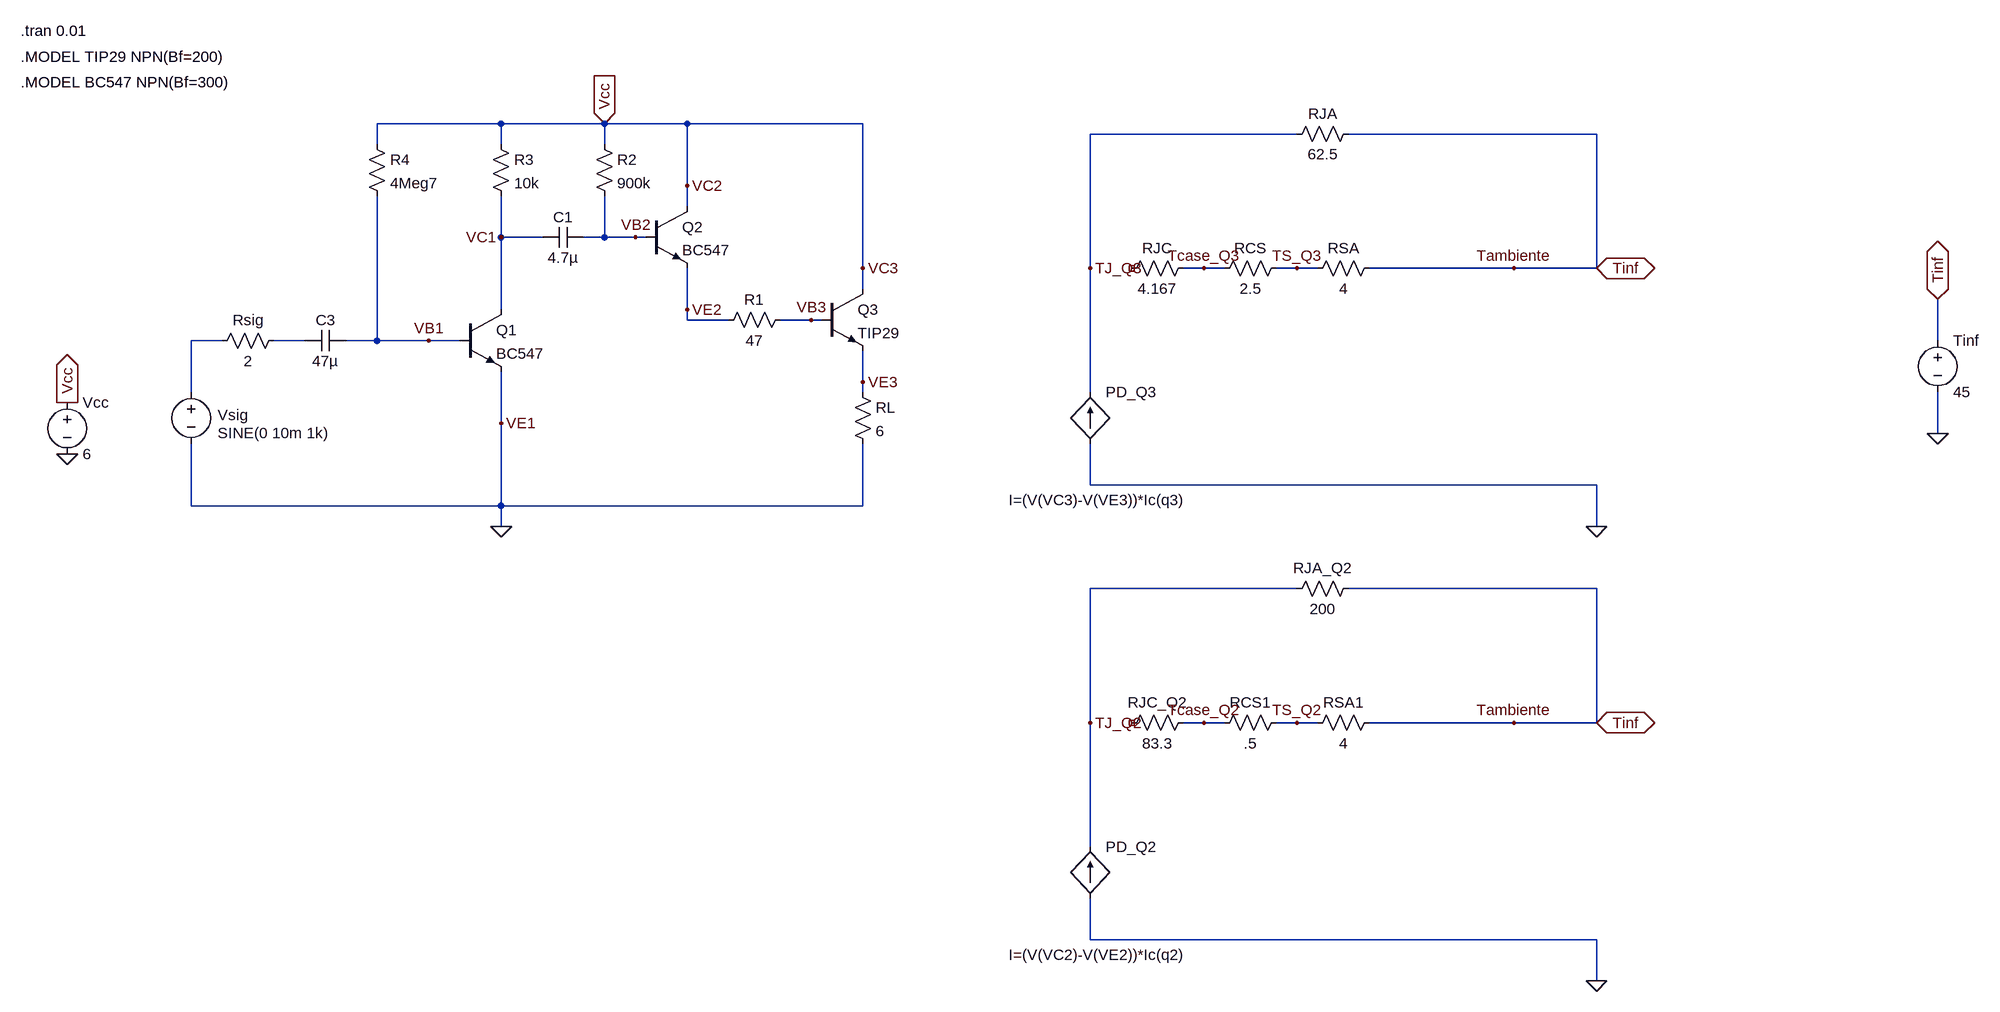
[diagram p0: schematic TBJ - Radio - AM - mod - Power Dissipation.asc]
TBJ - Radio - AM - mod - Power Dissipation.asc, the LTspice schematic file:
Version 4
SHEET 1 3324 1204
WIRE 208 -144 16 -144
WIRE 368 -144 208 -144
WIRE 496 -144 368 -144
WIRE 768 -144 496 -144
WIRE 1440 -128 1120 -128
WIRE 1904 -128 1520 -128
WIRE 16 -112 16 -144
WIRE 208 -112 208 -144
WIRE 368 -112 368 -144
WIRE 496 -48 496 -144
WIRE 496 -16 496 -48
WIRE 208 32 208 -32
WIRE 272 32 208 32
WIRE 368 32 368 -32
WIRE 368 32 336 32
WIRE 416 32 368 32
WIRE 432 32 416 32
WIRE 768 80 768 -144
WIRE 1120 80 1120 -128
WIRE 1296 80 1264 80
WIRE 1328 80 1296 80
WIRE 1440 80 1408 80
WIRE 1472 80 1440 80
WIRE 1776 80 1552 80
WIRE 1904 80 1904 -128
WIRE 1904 80 1776 80
WIRE 768 112 768 80
WIRE 208 144 208 32
WIRE 496 144 496 80
WIRE 496 160 496 144
WIRE 560 160 496 160
WIRE 688 160 640 160
WIRE 704 160 688 160
WIRE -224 192 -272 192
WIRE -96 192 -144 192
WIRE 16 192 16 -32
WIRE 16 192 -32 192
WIRE 96 192 16 192
WIRE 144 192 96 192
WIRE 2432 192 2432 128
WIRE 768 256 768 208
WIRE -272 272 -272 192
WIRE 768 272 768 256
WIRE 1120 272 1120 80
WIRE 208 320 208 240
WIRE 2432 336 2432 272
WIRE 1120 416 1120 352
WIRE 1904 416 1120 416
WIRE -272 448 -272 352
WIRE 208 448 208 320
WIRE 208 448 -272 448
WIRE 768 448 768 352
WIRE 768 448 208 448
WIRE 208 480 208 448
WIRE 1904 480 1904 416
WIRE 1440 576 1120 576
WIRE 1904 576 1520 576
WIRE 1120 784 1120 576
WIRE 1296 784 1264 784
WIRE 1328 784 1296 784
WIRE 1440 784 1408 784
WIRE 1472 784 1440 784
WIRE 1776 784 1552 784
WIRE 1904 784 1904 576
WIRE 1904 784 1776 784
WIRE 1120 976 1120 784
WIRE 1120 1120 1120 1056
WIRE 1904 1120 1120 1120
WIRE 1904 1184 1904 1120
FLAG 208 480 0
FLAG -464 368 0
FLAG -464 288 Vcc
IOPIN -464 288 Out
FLAG 368 -144 Vcc
IOPIN 368 -144 In
FLAG 768 80 VC3
FLAG 768 256 VE3
FLAG 496 144 VE2
FLAG 496 -48 VC2
FLAG 208 32 VC1
FLAG 208 320 VE1
FLAG 416 32 VB2
FLAG 688 160 VB3
FLAG 96 192 VB1
FLAG 1296 80 Tcase_Q3
FLAG 1120 80 TJ_Q3
FLAG 1904 480 0
FLAG 1776 80 Tambiente
FLAG 1440 80 TS_Q3
FLAG 1296 784 Tcase_Q2
FLAG 1120 784 TJ_Q2
FLAG 1904 1184 0
FLAG 1776 784 Tambiente
FLAG 1440 784 TS_Q2
FLAG 2432 336 0
FLAG 2432 128 Tinf
IOPIN 2432 128 BiDir
FLAG 1904 80 Tinf
IOPIN 1904 80 BiDir
FLAG 1904 784 Tinf
IOPIN 1904 784 BiDir
SYMBOL npn 144 144 R0
SYMATTR InstName Q1
SYMATTR Value BC547
SYMBOL npn 432 -16 R0
SYMATTR InstName Q2
SYMATTR Value BC547
SYMBOL npn 704 112 R0
SYMATTR InstName Q3
SYMATTR Value TIP29
SYMBOL res 752 256 R0
SYMATTR InstName RL
SYMATTR Value 6
SYMBOL res 656 144 R90
WINDOW 0 0 56 VBottom 2
WINDOW 3 32 56 VTop 2
SYMATTR InstName R1
SYMATTR Value 47
SYMBOL res 352 -128 R0
SYMATTR InstName R2
SYMATTR Value 900k
SYMBOL res 192 -128 R0
SYMATTR InstName R3
SYMATTR Value 10k
SYMBOL res 0 -128 R0
SYMATTR InstName R4
SYMATTR Value 4Meg7
SYMBOL cap 336 16 R90
WINDOW 0 0 32 VBottom 2
WINDOW 3 32 32 VTop 2
SYMATTR InstName C1
SYMATTR Value 4.7µ
SYMBOL cap -32 176 R90
WINDOW 0 0 32 VBottom 2
WINDOW 3 32 32 VTop 2
SYMATTR InstName C3
SYMATTR Value 47µ
SYMBOL voltage -272 256 R0
WINDOW 123 36 91 Left 2
WINDOW 39 0 0 Left 0
WINDOW 0 41 51 Left 2
WINDOW 3 41 79 Left 2
SYMATTR InstName Vsig
SYMATTR Value SINE(0 10m 1k)
SYMBOL voltage -464 272 R0
WINDOW 123 0 0 Left 0
WINDOW 39 0 0 Left 0
SYMATTR InstName Vcc
SYMATTR Value 6
SYMBOL res -128 176 R90
WINDOW 0 0 56 VBottom 2
WINDOW 3 32 56 VTop 2
SYMATTR InstName Rsig
SYMATTR Value 2
SYMBOL bi2 1120 272 R0
WINDOW 3 -126 167 Left 2
SYMATTR Value I=(V(VC3)-V(VE3))*Ic(q3)
SYMATTR InstName PD_Q3
SYMBOL res 1280 64 R90
WINDOW 0 0 56 VBottom 2
WINDOW 3 32 56 VTop 2
SYMATTR InstName RJC
SYMATTR Value 4.167
SYMBOL voltage 2432 176 R0
WINDOW 123 0 0 Left 0
WINDOW 39 0 0 Left 0
SYMATTR InstName Tinf
SYMATTR Value 45
SYMBOL res 1424 64 R90
WINDOW 0 0 56 VBottom 2
WINDOW 3 32 56 VTop 2
SYMATTR InstName RCS
SYMATTR Value 2.5
SYMBOL res 1568 64 R90
WINDOW 0 0 56 VBottom 2
WINDOW 3 32 56 VTop 2
SYMATTR InstName RSA
SYMATTR Value 4
SYMBOL res 1536 -144 R90
WINDOW 0 0 56 VBottom 2
WINDOW 3 32 56 VTop 2
SYMATTR InstName RJA
SYMATTR Value 62.5
SYMBOL bi2 1120 976 R0
WINDOW 3 -126 167 Left 2
SYMATTR Value I=(V(VC2)-V(VE2))*Ic(q2)
SYMATTR InstName PD_Q2
SYMBOL res 1280 768 R90
WINDOW 0 0 56 VBottom 2
WINDOW 3 32 56 VTop 2
SYMATTR InstName RJC_Q2
SYMATTR Value 83.3
SYMBOL res 1424 768 R90
WINDOW 0 0 56 VBottom 2
WINDOW 3 32 56 VTop 2
SYMATTR InstName RCS1
SYMATTR Value .5
SYMBOL res 1568 768 R90
WINDOW 0 0 56 VBottom 2
WINDOW 3 32 56 VTop 2
SYMATTR InstName RSA1
SYMATTR Value 4
SYMBOL res 1536 560 R90
WINDOW 0 0 56 VBottom 2
WINDOW 3 32 56 VTop 2
SYMATTR InstName RJA_Q2
SYMATTR Value 200
TEXT -536 -248 Left 2 !.MODEL TIP29 NPN(Bf=200)
TEXT -536 -288 Left 2 !.tran 0.01
TEXT -536 -208 Left 2 !.MODEL BC547 NPN(Bf=300)

The netlist it stands for:
* TBJ - Radio - AM - mod - Power Dissipation.asc
Q1 VC1 VB1 0 0 BC547
Q2 VC2 VB2 VE2 0 BC547
Q3 VC2 VB3 VE3 0 TIP29
RL VE3 0 6
R1 VB3 VE2 47
R2 VC2 VB2 900k
R3 VC2 VC1 10k
R4 VC2 VB1 4Meg7
C1 VB2 VC1 4.7µ
C3 VB1 N002 47µ
Vsig N001 0 SINE(0 10m 1k)
Vcc VC2 0 6
Rsig N002 N001 2
B§PD_Q3 0 TJ_Q3 I=(V(VC3)-V(VE3))*Ic(q3)
RJC Tcase_Q3 NC_01 4.167
V§Tinf Tinf 0 45
RCS TS_Q3 Tcase_Q3 2.5
RSA Tinf TS_Q3 4
RJA Tinf TJ_Q3 62.5
B§PD_Q2 0 TJ_Q2 I=(V(VC2)-V(VE2))*Ic(q2)
RJC_Q2 Tcase_Q2 NC_02 83.3
RCS1 TS_Q2 Tcase_Q2 .5
RSA1 Tinf TS_Q2 4
RJA_Q2 Tinf TJ_Q2 200
.model NPN NPN
.model PNP PNP
.lib standard.bjt
.MODEL TIP29 NPN(Bf=200)
.tran 0.01
.MODEL BC547 NPN(Bf=300)
.backanno
.end